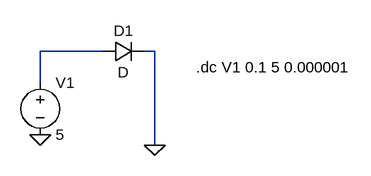
[diagram p0: schematic LTSPICE4.asc]
LTSPICE4.asc, the LTspice schematic file:
Version 4
SHEET 1 880 680
WIRE 192 48 96 48
WIRE 272 48 256 48
WIRE 96 96 96 48
WIRE 272 192 272 48
FLAG 272 192 0
FLAG 96 176 0
SYMBOL voltage 96 80 R0
SYMATTR InstName V1
SYMATTR Value 5
SYMBOL diode 192 64 R270
WINDOW 0 32 32 VTop 2
WINDOW 3 0 32 VBottom 2
SYMATTR InstName D1
TEXT 336 72 Left 2 !.dc V1 0.1 5 0.000001

The netlist it stands for:
* LTSPICE4.asc
V1 N001 0 5
D1 N001 0 D
.model D D
.lib standard.dio
.dc V1 0.1 5 0.000001
.backanno
.end